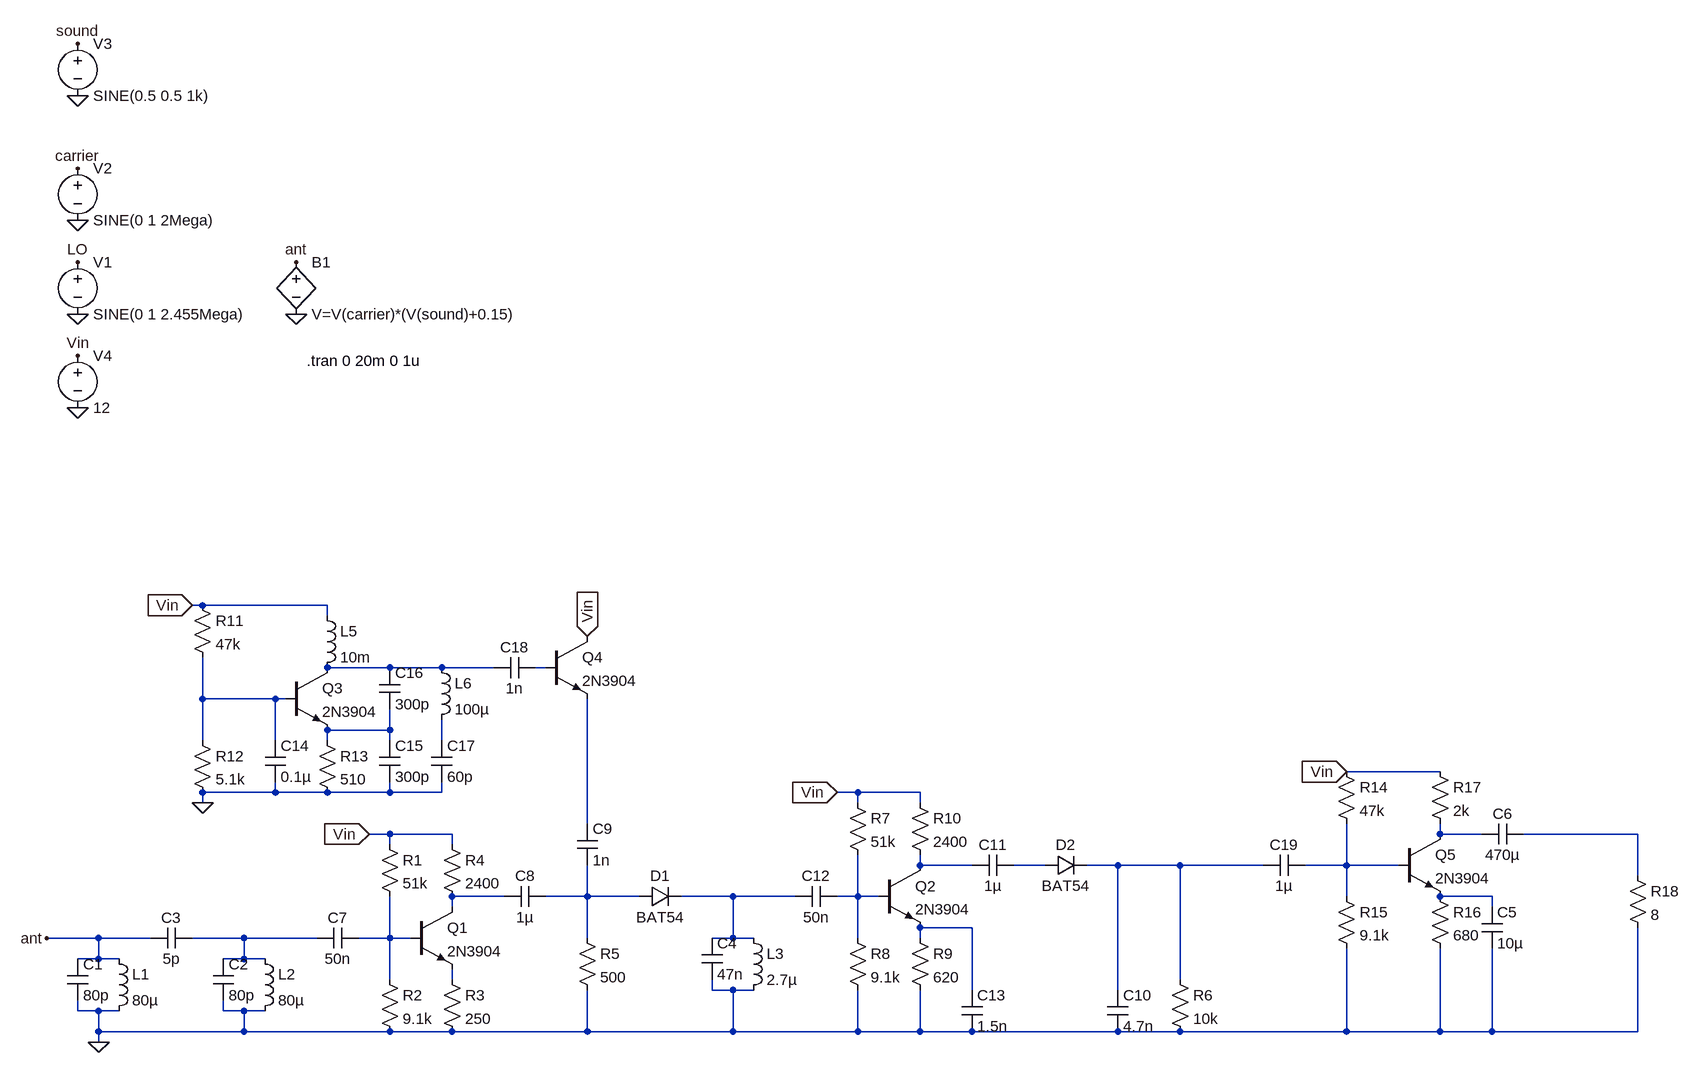
[diagram p0: schematic radio-sim.asc]
radio-sim.asc, the LTspice schematic file:
Version 4.1
SHEET 1 3192 1064
WIRE 96 80 80 80
WIRE 288 80 96 80
WIRE 288 96 288 80
WIRE 384 176 288 176
WIRE 464 176 384 176
WIRE 544 176 464 176
WIRE 624 176 608 176
WIRE 96 224 96 160
WIRE 208 224 96 224
WIRE 224 224 208 224
WIRE 384 272 384 240
WIRE 384 272 288 272
WIRE 96 288 96 224
WIRE 208 288 208 224
WIRE 288 288 288 272
WIRE 384 288 384 272
WIRE 464 288 464 256
WIRE 2000 336 1856 336
WIRE 208 368 208 352
WIRE 208 368 96 368
WIRE 288 368 208 368
WIRE 384 368 384 352
WIRE 384 368 288 368
WIRE 464 368 464 352
WIRE 464 368 384 368
WIRE 1104 368 1072 368
WIRE 1200 368 1104 368
WIRE 96 384 96 368
WIRE 1104 384 1104 368
WIRE 1200 384 1200 368
WIRE 688 416 688 224
WIRE 384 432 352 432
WIRE 480 432 384 432
WIRE 2000 432 2000 416
WIRE 2064 432 2000 432
WIRE 2304 432 2128 432
WIRE 384 448 384 432
WIRE 480 448 480 432
WIRE 1200 480 1200 464
WIRE 1280 480 1200 480
WIRE 1392 480 1344 480
WIRE 1504 480 1456 480
WIRE 1600 480 1504 480
WIRE 1728 480 1600 480
WIRE 1856 480 1856 416
WIRE 1856 480 1792 480
WIRE 1936 480 1856 480
WIRE 2304 496 2304 432
WIRE 560 528 480 528
WIRE 688 528 688 480
WIRE 688 528 624 528
WIRE 768 528 688 528
WIRE 912 528 832 528
WIRE 1008 528 912 528
WIRE 1104 528 1104 464
WIRE 1104 528 1072 528
WIRE 1136 528 1104 528
WIRE 1856 528 1856 480
WIRE 2080 528 2000 528
WIRE 480 544 480 528
WIRE 2080 544 2080 528
WIRE 1280 576 1200 576
WIRE -64 592 -144 592
WIRE 16 592 -64 592
WIRE 160 592 80 592
WIRE 272 592 160 592
WIRE 384 592 384 528
WIRE 384 592 336 592
WIRE 416 592 384 592
WIRE 688 592 688 528
WIRE 912 592 912 528
WIRE 912 592 880 592
WIRE 944 592 912 592
WIRE 1104 592 1104 528
WIRE 1200 592 1200 576
WIRE -64 624 -64 592
WIRE -64 624 -96 624
WIRE -32 624 -64 624
WIRE 160 624 160 592
WIRE 160 624 128 624
WIRE 192 624 160 624
WIRE 384 656 384 592
WIRE 480 656 480 640
WIRE 1600 656 1600 480
WIRE 880 672 880 656
WIRE 912 672 880 672
WIRE 944 672 912 672
WIRE 1280 672 1280 576
WIRE 1504 672 1504 480
WIRE -96 704 -96 688
WIRE -64 704 -96 704
WIRE -32 704 -64 704
WIRE 128 704 128 688
WIRE 160 704 128 704
WIRE 192 704 160 704
WIRE -64 736 -64 704
WIRE 160 736 160 704
WIRE 160 736 -64 736
WIRE 384 736 160 736
WIRE 480 736 384 736
WIRE 688 736 688 672
WIRE 688 736 480 736
WIRE 912 736 912 672
WIRE 912 736 688 736
WIRE 1104 736 1104 672
WIRE 1104 736 912 736
WIRE 1200 736 1200 672
WIRE 1200 736 1104 736
WIRE 1280 736 1200 736
WIRE 1504 736 1280 736
WIRE 1600 736 1504 736
WIRE 1856 736 1856 608
WIRE 1856 736 1600 736
WIRE 2000 736 2000 608
WIRE 2000 736 1856 736
WIRE 2080 736 2080 608
WIRE 2080 736 2000 736
WIRE 2304 736 2304 576
WIRE 2304 736 2080 736
WIRE -64 752 -64 736
FLAG -64 752 0
FLAG 352 432 Vin
IOPIN 352 432 In
FLAG -96 -368 0
FLAG -96 -448 LO
FLAG -96 -512 0
FLAG -96 -592 carrier
FLAG -96 -704 0
FLAG -96 -784 sound
FLAG 240 -448 ant
FLAG 240 -368 0
FLAG -144 592 ant
FLAG -96 -304 Vin
FLAG -96 -224 0
FLAG 1072 368 Vin
IOPIN 1072 368 In
FLAG 80 80 Vin
IOPIN 80 80 In
FLAG 96 384 0
FLAG 688 128 Vin
IOPIN 688 128 In
FLAG 1856 336 Vin
IOPIN 1856 336 In
SYMBOL cap -112 624 R0
SYMATTR InstName C1
SYMATTR Value 80p
SYMBOL ind -48 608 R0
SYMATTR InstName L1
SYMATTR Value 80µ
SYMATTR SpiceLine Rser=1m
SYMBOL cap 112 624 R0
SYMATTR InstName C2
SYMATTR Value 80p
SYMBOL ind 176 608 R0
SYMATTR InstName L2
SYMATTR Value 80µ
SYMATTR SpiceLine Rser=1m
SYMBOL cap 80 576 R90
WINDOW 0 0 32 VBottom 2
WINDOW 3 32 32 VTop 2
SYMATTR InstName C3
SYMATTR Value 5p
SYMBOL npn 416 544 R0
SYMATTR InstName Q1
SYMATTR Value 2N3904
SYMBOL diode 768 544 R270
WINDOW 0 32 32 VTop 2
WINDOW 3 0 32 VBottom 2
SYMATTR InstName D1
SYMATTR Value BAT54
SYMBOL cap 864 592 R0
SYMATTR InstName C4
SYMATTR Value 47n
SYMBOL ind 928 576 R0
SYMATTR InstName L3
SYMATTR Value 2.7µ
SYMATTR SpiceLine Rser=1m
SYMBOL cap 336 576 R90
WINDOW 0 0 32 VBottom 2
WINDOW 3 32 32 VTop 2
SYMATTR InstName C7
SYMATTR Value 50n
SYMBOL res 368 432 R0
SYMATTR InstName R1
SYMATTR Value 51k
SYMBOL res 368 640 R0
SYMATTR InstName R2
SYMATTR Value 9.1k
SYMBOL res 464 640 R0
SYMATTR InstName R3
SYMATTR Value 250
SYMBOL res 464 432 R0
SYMATTR InstName R4
SYMATTR Value 2400
SYMBOL voltage -96 -464 R0
WINDOW 123 0 0 Left 0
WINDOW 39 0 0 Left 0
SYMATTR InstName V1
SYMATTR Value SINE(0 1 2.455Mega)
SYMBOL voltage -96 -608 R0
WINDOW 123 0 0 Left 0
WINDOW 39 0 0 Left 0
SYMATTR InstName V2
SYMATTR Value SINE(0 1 2Mega)
SYMBOL voltage -96 -800 R0
WINDOW 123 0 0 Left 0
WINDOW 39 0 0 Left 0
SYMATTR InstName V3
SYMATTR Value SINE(0.5 0.5 1k)
SYMBOL bv 240 -464 R0
SYMATTR InstName B1
SYMATTR Value V=V(carrier)*(V(sound)+0.15)
SYMBOL voltage -96 -320 R0
WINDOW 123 0 0 Left 0
WINDOW 39 0 0 Left 0
SYMATTR InstName V4
SYMATTR Value 12
SYMBOL cap 624 512 R90
WINDOW 0 0 32 VBottom 2
WINDOW 3 32 32 VTop 2
SYMATTR InstName C8
SYMATTR Value 1µ
SYMBOL cap 672 416 R0
SYMATTR InstName C9
SYMATTR Value 1n
SYMBOL res 672 576 R0
SYMATTR InstName R5
SYMATTR Value 500
SYMBOL cap 1488 672 R0
SYMATTR InstName C10
SYMATTR Value 4.7n
SYMBOL diode 1392 496 R270
WINDOW 0 32 32 VTop 2
WINDOW 3 0 32 VBottom 2
SYMATTR InstName D2
SYMATTR Value BAT54
SYMBOL npn 1136 480 R0
SYMATTR InstName Q2
SYMATTR Value 2N3904
SYMBOL res 1088 368 R0
SYMATTR InstName R7
SYMATTR Value 51k
SYMBOL res 1088 576 R0
SYMATTR InstName R8
SYMATTR Value 9.1k
SYMBOL res 1184 576 R0
SYMATTR InstName R9
SYMATTR Value 620
SYMBOL res 1184 368 R0
SYMATTR InstName R10
SYMATTR Value 2400
SYMBOL cap 1344 464 R90
WINDOW 0 0 32 VBottom 2
WINDOW 3 32 32 VTop 2
SYMATTR InstName C11
SYMATTR Value 1µ
SYMBOL cap 1072 512 R90
WINDOW 0 0 32 VBottom 2
WINDOW 3 32 32 VTop 2
SYMATTR InstName C12
SYMATTR Value 50n
SYMBOL cap 1264 672 R0
SYMATTR InstName C13
SYMATTR Value 1.5n
SYMBOL res 1584 640 R0
SYMATTR InstName R6
SYMATTR Value 10k
SYMBOL npn 224 176 R0
SYMATTR InstName Q3
SYMATTR Value 2N3904
SYMBOL res 80 64 R0
SYMATTR InstName R11
SYMATTR Value 47k
SYMBOL res 80 272 R0
SYMATTR InstName R12
SYMATTR Value 5.1k
SYMBOL cap 192 288 R0
SYMATTR InstName C14
SYMATTR Value 0.1µ
SYMBOL res 272 272 R0
SYMATTR InstName R13
SYMATTR Value 510
SYMBOL cap 368 288 R0
SYMATTR InstName C15
SYMATTR Value 300p
SYMBOL cap 368 176 R0
SYMATTR InstName C16
SYMATTR Value 300p
SYMBOL ind 272 80 R0
SYMATTR InstName L5
SYMATTR Value 10m
SYMATTR SpiceLine Rser=1m
SYMBOL cap 448 288 R0
SYMATTR InstName C17
SYMATTR Value 60p
SYMBOL ind 448 160 R0
SYMATTR InstName L6
SYMATTR Value 100µ
SYMATTR SpiceLine Rser=1m
SYMBOL npn 624 128 R0
SYMATTR InstName Q4
SYMATTR Value 2N3904
SYMBOL cap 608 160 R90
WINDOW 0 0 32 VBottom 2
WINDOW 3 32 32 VTop 2
SYMATTR InstName C18
SYMATTR Value 1n
SYMBOL npn 1936 432 R0
SYMATTR InstName Q5
SYMATTR Value 2N3904
SYMBOL res 1840 320 R0
SYMATTR InstName R14
SYMATTR Value 47k
SYMBOL res 1840 512 R0
SYMATTR InstName R15
SYMATTR Value 9.1k
SYMBOL res 1984 512 R0
SYMATTR InstName R16
SYMATTR Value 680
SYMBOL cap 2064 544 R0
SYMATTR InstName C5
SYMATTR Value 10µ
SYMBOL res 1984 320 R0
SYMATTR InstName R17
SYMATTR Value 2k
SYMBOL cap 1792 464 R90
WINDOW 0 0 32 VBottom 2
WINDOW 3 32 32 VTop 2
SYMATTR InstName C19
SYMATTR Value 1µ
SYMBOL cap 2128 416 R90
WINDOW 0 0 32 VBottom 2
WINDOW 3 32 32 VTop 2
SYMATTR InstName C6
SYMATTR Value 470µ
SYMBOL res 2288 480 R0
SYMATTR InstName R18
SYMATTR Value 8
TEXT 256 -296 Left 2 !.tran 0 20m 0 1u

The netlist it stands for:
* radio-sim.asc
C1 ant 0 80p
L1 ant 0 80µ Rser=1m
C2 N019 0 80p
L2 N019 0 80µ Rser=1m
C3 N019 ant 5p
Q1 N013 N020 N021 0 2N3904
D1 N014 N015 BAT54
C4 N015 0 47n
L3 N015 0 2.7µ Rser=1m
C7 N020 N019 50n
R1 Vin N020 51k
R2 N020 0 9.1k
R3 N021 0 250
R4 Vin N013 2400
V1 LO 0 SINE(0 1 2.455Mega)
V2 carrier 0 SINE(0 1 2Mega)
V3 sound 0 SINE(0.5 0.5 1k)
B1 ant 0 V=V(carrier)*(V(sound)+0.15)
V4 Vin 0 12
C8 N014 N013 1µ
C9 N006 N014 1n
R5 N014 0 500
C10 N011 0 4.7n
D2 N010 N011 BAT54
Q2 N009 N016 N018 0 2N3904
R7 Vin N016 51k
R8 N016 0 9.1k
R9 N018 0 620
R10 Vin N009 2400
C11 N010 N009 1µ
C12 N016 N015 50n
C13 N018 0 1.5n
R6 N011 0 10k
Q3 N001 N003 N004 0 2N3904
R11 Vin N003 47k
R12 N003 0 5.1k
C14 N003 0 0.1µ
R13 N004 0 510
C15 N004 0 300p
C16 N001 N004 300p
L5 Vin N001 10m Rser=1m
C17 N005 0 60p
L6 N001 N005 100µ Rser=1m
Q4 Vin N002 N006 0 2N3904
C18 N002 N001 1n
Q5 N007 N012 N017 0 2N3904
R14 Vin N012 47k
R15 N012 0 9.1k
R16 N017 0 680
C5 N017 0 10µ
R17 Vin N007 2k
C19 N012 N011 1µ
C6 N008 N007 470µ
R18 N008 0 8
.model D D
.lib standard.dio
.model NPN NPN
.model PNP PNP
.lib standard.bjt
.tran 0 20m 0 1u
.backanno
.end